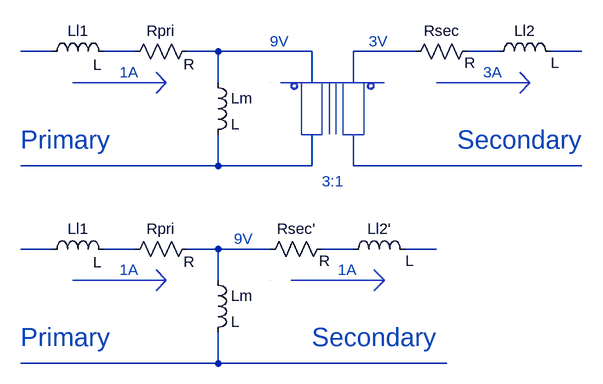
[diagram p0: schematic transformer_non-linear_schematic.asc]
transformer_non-linear_schematic.asc, the LTspice schematic file:
Version 4
SHEET 1 880 680
WIRE -176 64 -224 64
WIRE -48 64 -96 64
WIRE 80 64 32 64
WIRE 224 64 80 64
WIRE 384 64 288 64
WIRE 512 64 464 64
WIRE 640 64 592 64
WIRE 80 112 80 64
WIRE 224 112 224 64
WIRE 288 112 288 64
WIRE 80 240 80 192
WIRE 80 240 -224 240
WIRE 224 240 224 192
WIRE 224 240 80 240
WIRE 288 240 288 192
WIRE 640 240 288 240
WIRE -176 368 -224 368
WIRE -48 368 -96 368
WIRE 80 368 32 368
WIRE 160 368 80 368
WIRE 288 368 240 368
WIRE 416 368 368 368
WIRE 80 416 80 368
WIRE 80 544 80 496
WIRE 80 544 -224 544
WIRE 432 544 80 544
SYMBOL ind 64 96 R0
SYMATTR InstName Lm
SYMBOL res 48 48 R90
WINDOW 0 0 56 VBottom 2
WINDOW 3 20 13 VTop 2
SYMATTR InstName Rpri
SYMBOL res 480 48 R90
WINDOW 0 0 56 VBottom 2
WINDOW 3 18 12 VTop 2
SYMATTR InstName Rsec
SYMBOL ind -192 80 R270
WINDOW 0 32 56 VTop 2
WINDOW 3 11 86 VBottom 2
SYMATTR InstName Ll1
SYMBOL ind 496 80 R270
WINDOW 0 32 56 VTop 2
WINDOW 3 14 103 VBottom 2
SYMATTR InstName Ll2
SYMBOL ind 64 400 R0
SYMATTR InstName Lm
SYMBOL res 48 352 R90
WINDOW 0 0 56 VBottom 2
WINDOW 3 20 13 VTop 2
SYMATTR InstName Rpri
SYMBOL res 256 352 R90
WINDOW 0 0 56 VBottom 2
WINDOW 3 18 12 VTop 2
SYMATTR InstName Rsec'
SYMBOL ind -192 384 R270
WINDOW 0 32 56 VTop 2
WINDOW 3 11 86 VBottom 2
SYMATTR InstName Ll1
SYMBOL ind 272 384 R270
WINDOW 0 32 56 VTop 2
WINDOW 3 14 103 VBottom 2
SYMATTR InstName Ll2'
TEXT -224 200 Left 4 ;Primary
TEXT 448 200 Left 4 ;Secondary
TEXT 240 264 Left 2 ;3:1
TEXT 160 48 Left 2 ;9V
TEXT 312 48 Left 2 ;3V
TEXT -72 96 Left 2 ;1A
TEXT 488 96 Left 2 ;3A
TEXT -224 504 Left 4 ;Primary
TEXT 224 504 Left 4 ;Secondary
TEXT 104 352 Left 2 ;9V
TEXT -72 400 Left 2 ;1A
TEXT 264 400 Left 2 ;1A
LINE Normal 251 191 251 111
LINE Normal 261 191 261 111
LINE Normal 0 112 -144 112
LINE Normal -16 96 0 112
LINE Normal -16 128 0 112
LINE Normal 560 112 416 112
LINE Normal 544 96 560 112
LINE Normal 544 128 560 112
LINE Normal 0 416 -144 416
LINE Normal -16 400 0 416
LINE Normal -16 432 0 416
LINE Normal 336 416 192 416
LINE Normal 320 400 336 416
LINE Normal 320 432 336 416
RECTANGLE Normal 240 192 208 112
RECTANGLE Normal 304 192 272 112
CIRCLE Normal 192 128 192 128 2
CIRCLE Normal 336 112 176 112 2
CIRCLE Normal 160 112 160 112 2
CIRCLE Normal 202 122 192 112
CIRCLE Normal 201 121 193 113
CIRCLE Normal 320 122 310 112
CIRCLE Normal 319 121 311 113
CIRCLE Normal 160 416 160 416 2

The netlist it stands for:
* transformer_non-linear_schematic.asc
Lm N003 N007 L
Rpri N003 N002 R
Rsec N005 N004 R
Ll1 N001 N002 L
Ll2 N005 N006 L
Lm N011 N014 L
Rpri N011 N010 R
Rsec' N012 N011 R
Ll1 N009 N010 L
Ll2' N012 N013 L
* Primary
* Secondary
* 3:1
* 9V
* 3V
* 1A
* 3A
* Primary
* Secondary
* 9V
* 1A
* 1A
.backanno
.end